# Altium schematic sheet AIM2 - WDT REVB.SchDoc: Watchdog Timer
size B; DrawnBy: DJW; DocumentNumber: 12; SheetNumber: 12; SheetTotal: 12
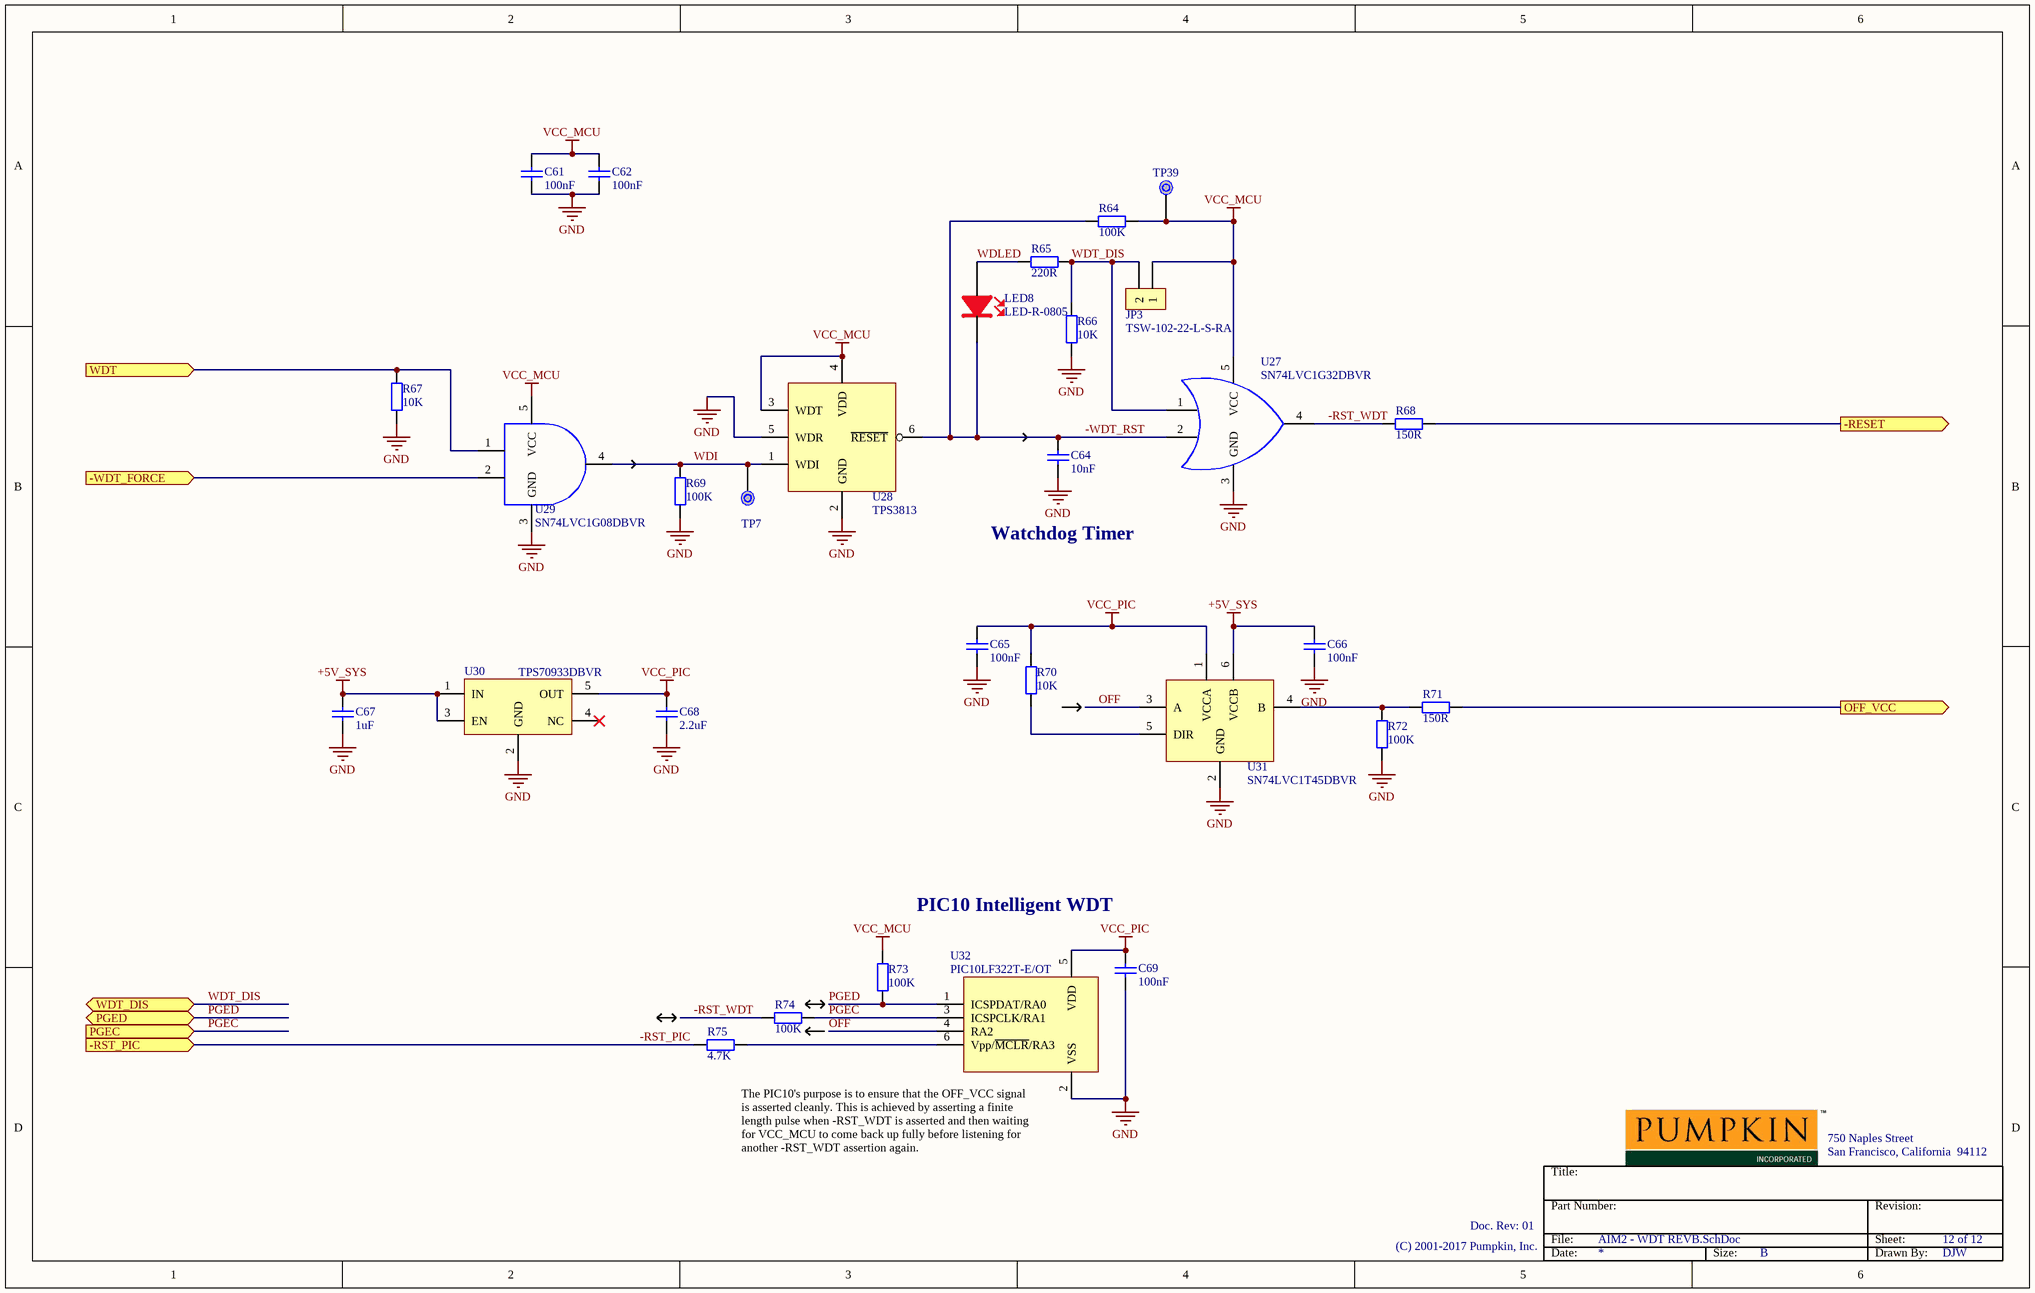
[diagram p0: AIM2 - WDT REVB.SchDoc]

## Parts
C61  100nF  [0603 CAP]
C62  100nF  [0603 CAP]
C64  10nF  [0805 CAP]
C65  100nF  [0603 CAP]
C66  100nF  [0603 CAP]
C67  1uF  [0805 CAP]
C68  2.2uF  [0805 CAP]
C69  100nF  [0603 CAP]
JP3  TSW-102-22-L-S-RA  [TSW-102-22-L-S-RA]
LED8  LED-R-0805  [0805 LED-RED]
R64  100K  [0805 RES]
R65  220R  [0805 RES]
R66  10K  [0805 RES]
R67  10K  [0805 RES]
R68  150R  [0805 RES]
R69  100K  [0805 RES]
R70  10K  [0805 RES]
R71  150R  [0805 RES]
R72  100K  [0805 RES]
R73  100K  [0805 RES]
R74  100K  [0805 RES]
R75  4.7K  [0805 RES]
TP7  Testpoint  [Testpoint]  (value not drawn)  (no BOM)
TP39  Testpoint  [Testpoint]  (value not drawn)  (no BOM)
U27  SN74LVC1G32DBVR  [SOT23-5]
U28  TPS3813  [SOT23-6]
U29  SN74LVC1G08DBVR  [SOT23-5]
U30  TPS70933DBVR  [SOT23-5]
U31  SN74LVC1T45DBVR  [SOT23-6]
U32  PIC10LF322T-E/OT  [SOT23-6]

## Ports
-RESET (out), -RST_PIC (in), -WDT_FORCE (in), OFF_VCC (out), PGEC (in), PGED (bidir), WDT (in), WDT_DIS (bidir)

## Nets
+5V_SYS: C66.2 C67.1 U30.1(IN) U30.3(EN) U31.6(VCCB)
GND: C61.1 C62.1 C64.1 C65.1 C66.1 C67.2 C68.1 C69.1 R66.1 R67.1 R69.1 R72.2 U27.3(GND) U28.2(GND) U28.5(WDR) U29.3(GND) U30.2(GND) U31.2(GND) U32.2(VSS)
VCC_MCU: C61.2 C62.2 JP3.1 R64.1 R73.2 TP39.1 U27.5(VCC) U28.3(WDT) U28.4(VDD) U29.5(VCC)
VCC_PIC: C65.2 C68.2 C69.2 R70.2 U30.5(OUT) U31.1(VCCA) U32.5(VDD)
-RESET: R68.2 ; port -RESET
-RST_PIC: R75.2 ; port -RST_PIC
-RST_WDT: R68.1 R74.1 U27.4(A+B)
-WDT_FORCE: U29.2 ; port -WDT_FORCE
-WDT_RST: C64.2 LED8.1 R64.2 U27.2(1B) U28.6(~{RESET})
OFF: U31.3(A) U32.4(RA2)
OFF_VCC: R71.2 ; port OFF_VCC
PGEC: R74.2 U32.3(ICSPCLK/RA1) ; port PGEC
PGED: R73.1 U32.1(ICSPDAT/RA0) ; port PGED
WDI: R69.2 TP7.1 U28.1(WDI) U29.4
WDLED: LED8.2 R65.1
WDT: R67.2 U29.1 ; port WDT
WDT_DIS: JP3.2 R65.2 R66.2 U27.1(1A) ; port WDT_DIS
NetR70_1: R70.1 U31.5(DIR)
NetR71_1: R71.1 R72.1 U31.4(B)
NetR75_1: R75.1 U32.6(Vpp/~{MCLR}/RA3)

Not connected (* = marked no-connect by the designer): U30 4(NC)*

## Notes on the sheet
- Watchdog Timer
- PIC10 Intelligent WDT
- (near U32) The PIC10's purpose is to ensure that the OFF_VCC signal is asserted cleanly. This is achieved by asserting a finite length pulse when -RST_WDT is asserted and then waiting for VCC_MCU to come back up fully before listening for another -RST_WDT assertion again.
- Title:
- 750 Naples Street
- San Francisco, California  94112
- Doc. Rev: 01
- File:
- Part Number:
- Revision:
- Sheet:
- (C) 2001-2017 Pumpkin, Inc.
- Date:
- Size:
- B
- Drawn By:

## Library data of the parts
C61 C62 C65 C66 C69 = Capacitor 100nF 0603: Capacitor 100nF 0603 X7R 50V 5%; Value: 100nF; Supplier 1: Digi-Key; Supplier Part Number 1: 399-7844-1-ND
C64 = Capacitor 10nF 0805: Capacitor 10nF 0805 X7R 50V 5%; Value: 10nF; Supplier 1: Digi-Key; Supplier Part Number 1: 478-3768-1-ND
C67 = Capacitor 1uF 0805: Capacitor 1uF 0805 X7R 25V 10%; Value: 1uF; Supplier 1: Digi-Key; Supplier Part Number 1: 445-5687-1-ND
C68 = Capacitor 2.2uF 0805: Capacitor 2.2uF 0805 X7R 35V 10%; Voltage Rating: 50V; Value: 2.2uF; Supplier 1: Digi-Key; Supplier Part Number 1: 445-8787-1-ND
JP3 = 2x1 RA Header TH raised: Header 2x1 RA TH raised; Supplier 1: Digi-Key; Supplier Part Number 1: TSW-102-22-L-S-RA-ND
LED8 = LED RED 0805: Supplier 1: Digi-Key; Supplier Part Number 1: 160-1415-1-ND
R64 R69 R72-R74 = Resistor 100K 0805: Resistor 100K 0805 0.5W 1%; Revision: Altium ETH 11-03.2008; Value: 100K; Supplier 1: Digi-Key; Supplier Part Number 1: P16060CT-ND
R65 = Resistor 220R 0805: Resistor 220R 0805 0.125W 1%; Revision: Altium ETH 11-03.2008; Value: 220R; Supplier 1: Digi-Key; Supplier Part Number 1: P220CCT-ND
R66 R67 R70 = Resistor 10K 0805: Resistor 10K 0805 0.125W 1%; Revision: Altium ETH 11-03.2008; Supplier 1: Digi-Key; Supplier Part Number 1: 311-10.0KCRCT-ND; Value: 10K
R68 R71 = Resistor 150R 0805: Resistor 150R 0805 0.125W 1%; Revision: Altium ETH 11-03.2008; Value: 150R; Supplier 1: Digi-Key; Supplier Part Number 1: P150CCT-ND
R75 = Resistor 4K7 0805: Resistor 4.7K 0805 0.125W 1%; Revision: Altium ETH 11-03.2008; Value: 4.7K; Supplier 1: Digi-Key; Supplier Part Number 1: 311-4.70KCRCT-ND
U27 = SN74LVC1G32DBVR: IC Logic OR 1 channel; Supplier 1: Digi-Key; Supplier Part Number 1: 296-9847-1-ND
U28 = TPS3813: IC Supervisor Watchdog; Supplier 1: Digi-Key; Supplier Part Number 1: 296-10920-1-ND
U29 = SN74LVC1G08DBVR: IC Logic AND 2 input; Supplier 1: Digi-Key; Supplier Part Number 1: 296-11601-1-ND
U30 = TPS70933: Regulator 3.3 V LDO; Supplier 1: Digi-Key; Supplier Part Number 1: 296-35483-1-ND
U31 = SN74LVC1T45DBVR: IC Logic Isolator 1 channel; Supplier 1: Digi-Key; Supplier Part Number 1: 296-16843-1-ND
U32 = PIC10LF322T-E/OT: IC Processor 8 bit; Supplier 1: Digi-Key; Supplier Part Number 1: PIC10LF322T-E/OTCT-ND